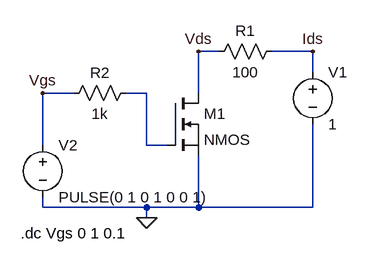
[diagram p0: schematic NMOS Vth.asc]
NMOS Vth.asc, the LTspice schematic file:
Version 4
SHEET 1 880 680
WIRE 176 32 144 32
WIRE 320 32 256 32
WIRE 320 64 320 32
WIRE -48 96 -96 96
WIRE 64 96 32 96
WIRE 144 96 144 32
WIRE -96 176 -96 96
WIRE 64 176 64 96
WIRE 96 176 64 176
WIRE -96 272 -96 256
WIRE 64 272 -96 272
WIRE 144 272 144 192
WIRE 144 272 64 272
WIRE 320 272 320 144
WIRE 320 272 144 272
WIRE 64 288 64 272
FLAG 64 288 0
FLAG 144 32 Vds
FLAG 320 32 Ids
FLAG -96 96 Vgs
SYMBOL nmos 96 96 R0
SYMATTR InstName M1
SYMBOL voltage 320 48 R0
WINDOW 123 0 0 Left 0
WINDOW 39 0 0 Left 0
SYMATTR InstName V1
SYMATTR Value 1
SYMBOL voltage -96 160 R0
WINDOW 123 0 0 Left 0
WINDOW 39 0 0 Left 0
SYMATTR InstName V2
SYMATTR Value PULSE(0 1 0 1 0 0 1)
SYMBOL res 272 16 R90
WINDOW 0 0 56 VBottom 2
WINDOW 3 32 56 VTop 2
SYMATTR InstName R1
SYMATTR Value 100
SYMBOL res 48 80 R90
WINDOW 0 0 56 VBottom 2
WINDOW 3 32 56 VTop 2
SYMATTR InstName R2
SYMATTR Value 1k
TEXT -130 312 Left 2 !.dc Vgs 0 1 0.1

The netlist it stands for:
* NMOS Vth.asc
M1 Vds N001 0 0 NMOS
V1 Ids 0 1
V2 Vgs 0 PULSE(0 1 0 1 0 0 1)
R1 Ids Vds 100
R2 N001 Vgs 1k
.model NMOS NMOS
.model PMOS PMOS
.lib standard.mos
.dc Vgs 0 1 0.1
.backanno
.end